# EAGLE design project_2 (EAGLE 9.6.2)
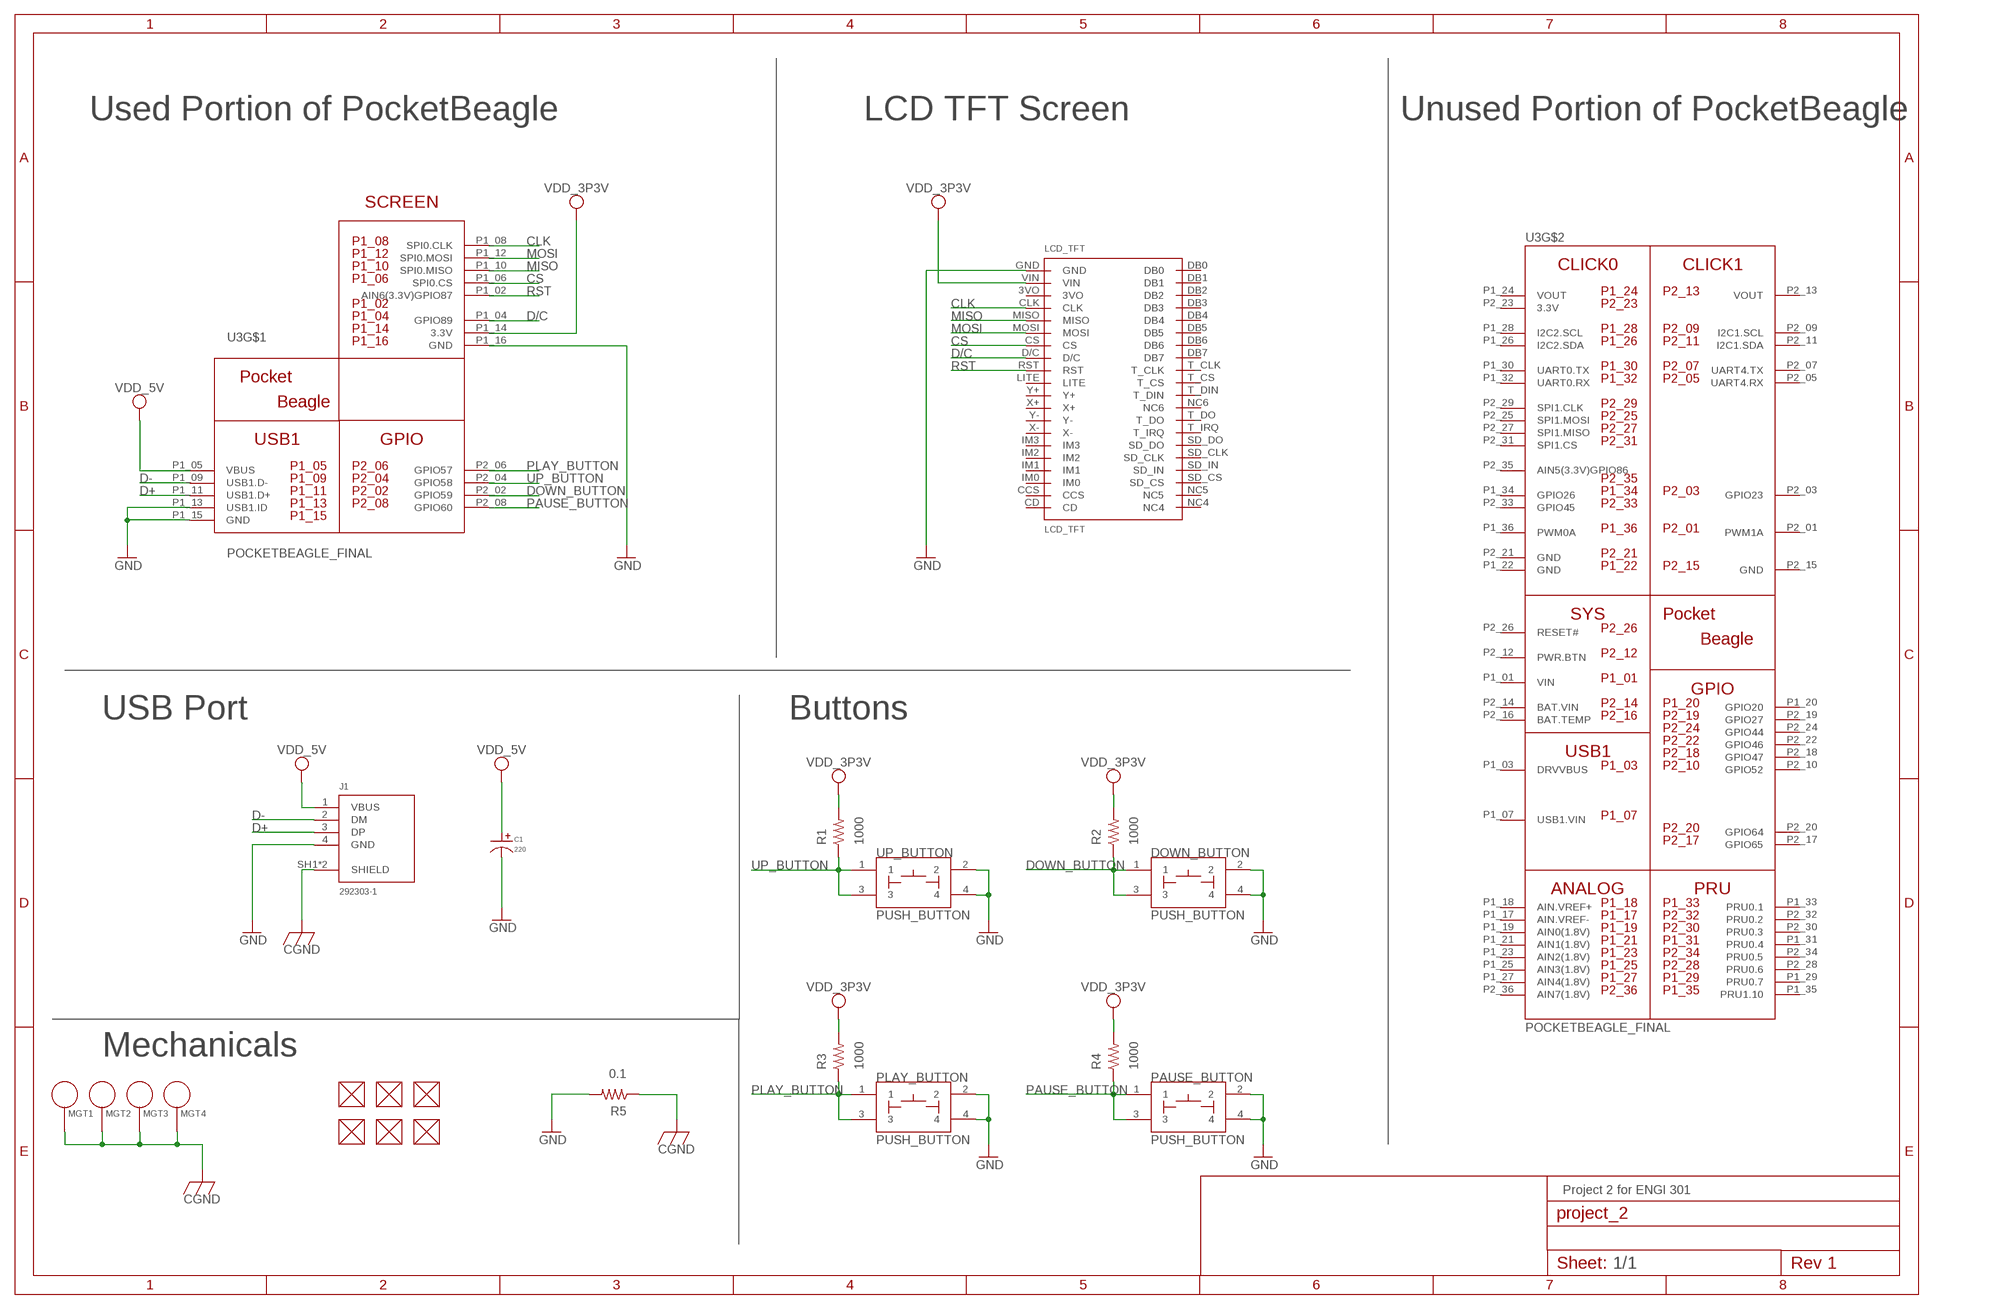
[diagram p0: schematic, sheet 1]

## Parts
C1  220  CAPACITOR_P_10MM  [CP10MM]
DOWN_BUTTON  PUSH_BUTTON  [BUTTON_12.5MM]
FUD1  FIDUCIAL  [FIDUCIAL_40MIL]
FUD2  FIDUCIAL  [FIDUCIAL_40MIL]
FUD3  FIDUCIAL  [FIDUCIAL_40MIL]
FUD4  FIDUCIAL  [FIDUCIAL_40MIL]
FUD5  FIDUCIAL  [FIDUCIAL_40MIL]
FUD6  FIDUCIAL  [FIDUCIAL_40MIL]
J1  292303-1  [TE_292303-1]
LCD_TFT  LCD_TFT  [LCD_TFT]
MGT1  MOUNTING_HOLE  [MOUNTING_HOLE]
MGT2  MOUNTING_HOLE  [MOUNTING_HOLE]
MGT3  MOUNTING_HOLE  [MOUNTING_HOLE]
MGT4  MOUNTING_HOLE  [MOUNTING_HOLE]
PAUSE_BUTTON  PUSH_BUTTON  [BUTTON_12.5MM]
PLAY_BUTTON  PUSH_BUTTON  [BUTTON_12.5MM]
R1  1000  R_R0603  [R0603]
R2  1000  R_R0603  [R0603]
R3  1000  R_R0603  [R0603]
R4  1000  R_R0603  [R0603]
R5  0.1  R_R0603  [R0603]
U3  POCKETBEAGLE_FINAL  [POCKETBEAGLE]
UP_BUTTON  PUSH_BUTTON  [BUTTON_12.5MM]

## Nets
CGND: J1.SH1(SHIELD) J1.SH2(SHIELD) MGT1.P$1 MGT2.P$1 MGT3.P$1 MGT4.P$1 R5.1
CLK: LCD_TFT.CLK U3.P1_08(SPI0.CLK)
CS: LCD_TFT.CS U3.P1_06(SPI0.CS)
D+: J1.3(DP) U3.P1_11(USB1.D+)
D-: J1.2(DM) U3.P1_09(USB1.D-)
D/C: LCD_TFT.D/C U3.P1_04(GPIO89)
DOWN_BUTTON: DOWN_BUTTON.1 DOWN_BUTTON.3 R2.1 U3.P2_02(GPIO59)
GND: C1.P$2 DOWN_BUTTON.2 DOWN_BUTTON.4 J1.4(GND) LCD_TFT.GND PAUSE_BUTTON.2 PAUSE_BUTTON.4 PLAY_BUTTON.2 PLAY_BUTTON.4 R5.2 U3.P1_13(USB1.ID) U3.P1_15(GND) U3.P1_16(GND) UP_BUTTON.2 UP_BUTTON.4
MISO: LCD_TFT.MISO U3.P1_10(SPI0.MISO)
MOSI: LCD_TFT.MOSI U3.P1_12(SPI0.MOSI)
PAUSE_BUTTON: PAUSE_BUTTON.1 PAUSE_BUTTON.3 R4.1 U3.P2_08(GPIO60)
PLAY_BUTTON: PLAY_BUTTON.1 PLAY_BUTTON.3 R3.1 U3.P2_06(GPIO57)
RST: LCD_TFT.RST U3.P1_02(AIN6(3.3V)GPIO87)
UP_BUTTON: R1.1 U3.P2_04(GPIO58) UP_BUTTON.1 UP_BUTTON.3
VDD_3P3V: LCD_TFT.VIN R1.2 R2.2 R3.2 R4.2 U3.P1_14(3.3V)
VDD_5V: C1.P$1 J1.1(VBUS) U3.P1_05(VBUS)
Unconnected: FUD1.P$1 FUD2.P$1 FUD3.P$1 FUD4.P$1 FUD5.P$1 FUD6.P$1 LCD_TFT.3VO LCD_TFT.CCS LCD_TFT.CD LCD_TFT.DB0 LCD_TFT.DB1 LCD_TFT.DB2 LCD_TFT.DB3 LCD_TFT.DB4 LCD_TFT.DB5 LCD_TFT.DB6 LCD_TFT.DB7 LCD_TFT.IM0 LCD_TFT.IM1 LCD_TFT.IM2 LCD_TFT.IM3 LCD_TFT.LITE LCD_TFT.NC4 LCD_TFT.NC5 LCD_TFT.NC6 LCD_TFT.SD_CLK LCD_TFT.SD_CS LCD_TFT.SD_DO LCD_TFT.SD_IN LCD_TFT.T_CLK LCD_TFT.T_CS LCD_TFT.T_DIN LCD_TFT.T_DO LCD_TFT.T_IRQ LCD_TFT.X+ LCD_TFT.X- LCD_TFT.Y+ LCD_TFT.Y- U3.P1_03(DRVVBUS) U3.P1_07(USB1.VIN) U3.P1_17(AIN.VREF-) U3.P1_18(AIN.VREF+) U3.P1_19(AIN0(1.8V)) U3.P1_20(GPIO20) U3.P1_21(AIN1(1.8V)) U3.P1_23(AIN2(1.8V)) U3.P1_25(AIN3(1.8V)) U3.P1_26(I2C2.SDA) U3.P1_27(AIN4(1.8V)) U3.P1_28(I2C2.SCL) U3.P1_29(PRU0.7) U3.P1_30(UART0.TX) U3.P1_31(PRU0.4) U3.P1_32(UART0.RX) U3.P1_33(PRU0.1) U3.P1_34(GPIO26) U3.P1_35(PRU1.10) U3.P1_36(PWM0A) U3.P2_01(PWM1A) U3.P2_03(GPIO23) U3.P2_05(UART4.RX) U3.P2_07(UART4.TX) U3.P2_09(I2C1.SCL) U3.P2_10(GPIO52) U3.P2_11(I2C1.SDA) U3.P2_12(PWR.BTN) U3.P2_16(BAT.TEMP) U3.P2_17(GPIO65) U3.P2_18(GPIO47) U3.P2_19(GPIO27) U3.P2_20(GPIO64) U3.P2_22(GPIO46) U3.P2_24(GPIO44) U3.P2_25(SPI1.MOSI) U3.P2_26(RESET#) U3.P2_27(SPI1.MISO) U3.P2_28(PRU0.6) U3.P2_29(SPI1.CLK) U3.P2_30(PRU0.3) U3.P2_31(SPI1.CS) U3.P2_32(PRU0.2) U3.P2_33(GPIO45) U3.P2_34(PRU0.5) U3.P2_35(AIN5(3.3V)GPIO86) U3.P2_36(AIN7(1.8V))

## Notes on the sheet
- Used Portion of PocketBeagle | LCD TFT Screen | Unused Portion of PocketBeagle
- POCKETBEAGLE_FINAL
- USB Port | Buttons
- Mechanicals
- Project 2 for ENGI 301
- 1/1

## Power pins joined to a net without a drawn wire
3.3V: U3.P2_23(3.3V)
BAT.VIN: U3.P2_14(BAT.VIN)
GND: U3.P1_22(GND) U3.P2_15(GND) U3.P2_21(GND)
VIN: U3.P1_01(VIN)
VOUT: U3.P1_24(VOUT) U3.P2_13(VOUT)

## Library data of the parts
C1 = project_2:CAPACITOR_P: Library: MF_Passives Description: Device for Polarized Capacitors. Manufacture part number (MPN), Voltage Rating, and Tolerance can be added via Attributes. Check https://factory.macrofab.com/parts for the house parts list.; POPULATE: 1
DOWN_BUTTON PAUSE_BUTTON PLAY_BUTTON UP_BUTTON = project_2:PUSH_BUTTON
FUD1-FUD6 = project_2:FIDUCIAL
J1 = project_2:292303-1: CONN USB RECEPT R/A TYPE A 4POS; CENTERLINE_PITCH: 2 mm[.078 in]; COMMENT: 292303-1; DESCRIPTION: Conn; Data; USB; Recept; 2.0; 4 Pos; 1 Port; Rt Angle; A Ser; Tin over Copper; DIGI-KEY_PART_NUMBER: A31726-ND; EU_ROHS_COMPLIANCE: Compliant; MF: TE Connectivity; MP: 292303-1; NUMBER_OF_POSITIONS: 4; PACKAGE: None; PRODUCT_TYPE: Connector; PURCHASE-URL: https://pricing.snapeda.com/search/part/292303-1/?ref=eda
LCD_TFT = project_2:LCD_TFT
MGT1-MGT4 = project_2:MOUNTING_HOLE: Chassis Mounting Hole w/GND connection ability
R1-R5 = project_2:R_: RESISTOR, American symbol
U3 = project_2:POCKETBEAGLE_FINAL

## Board
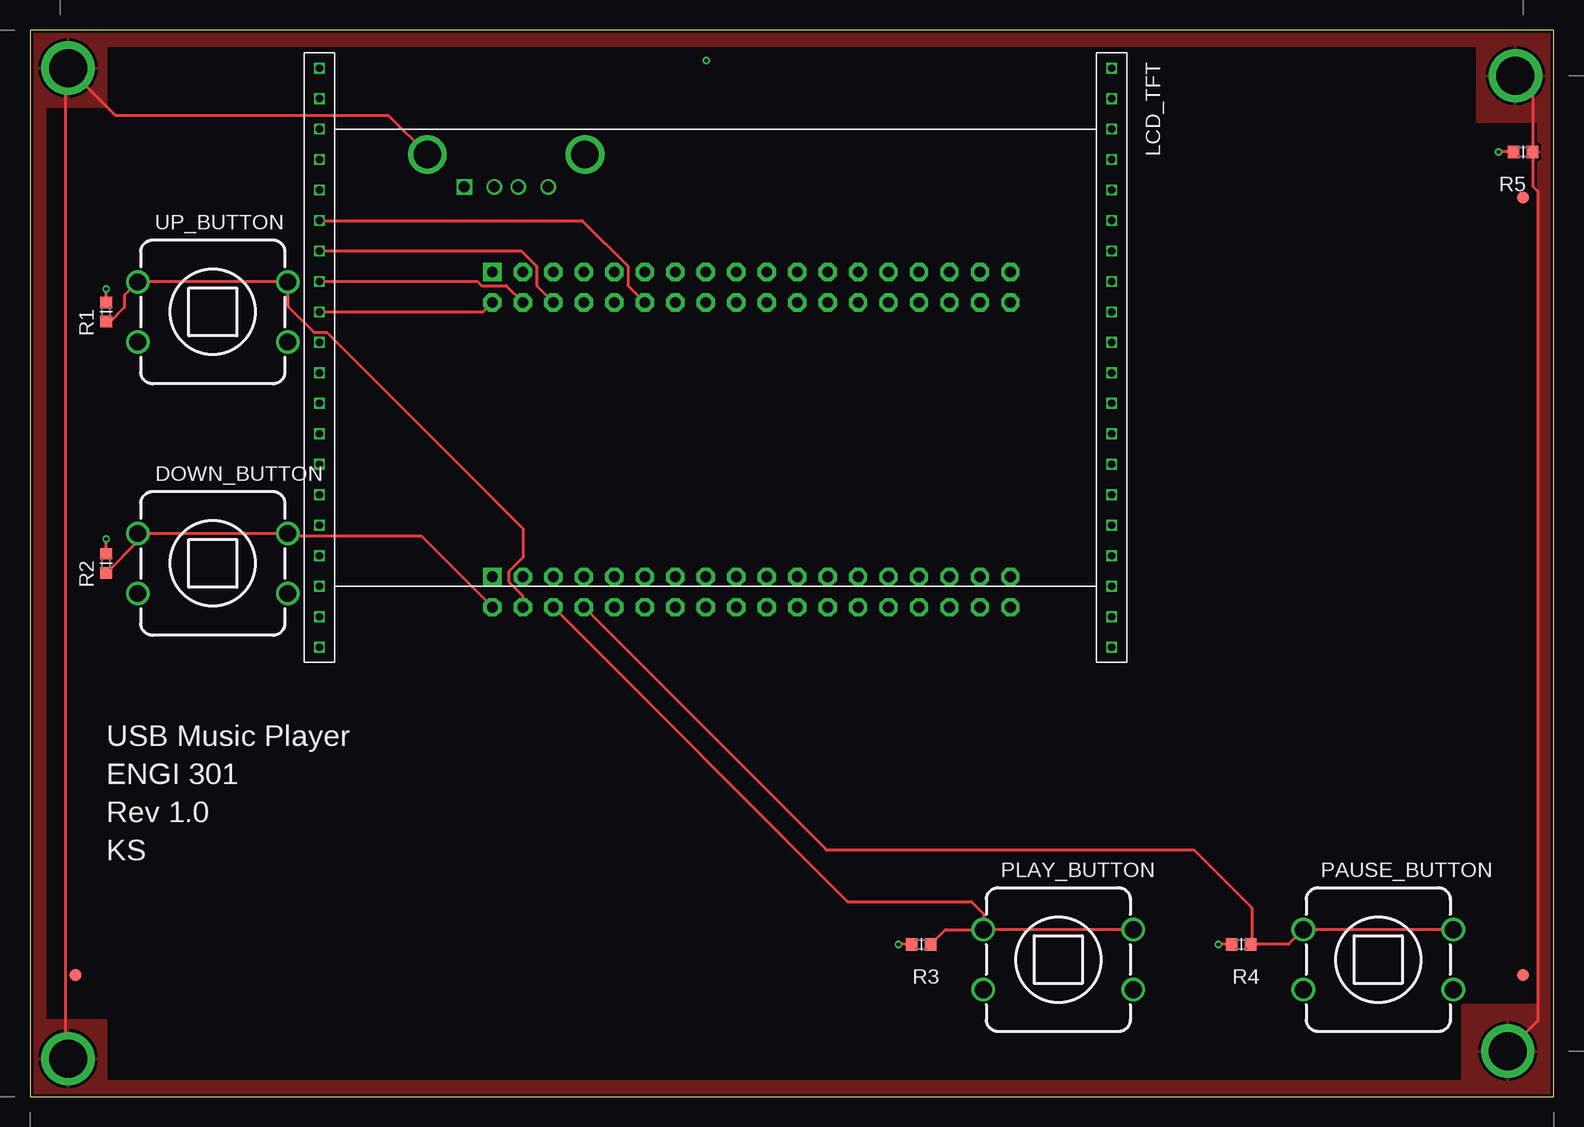
[diagram p1: board, top side]
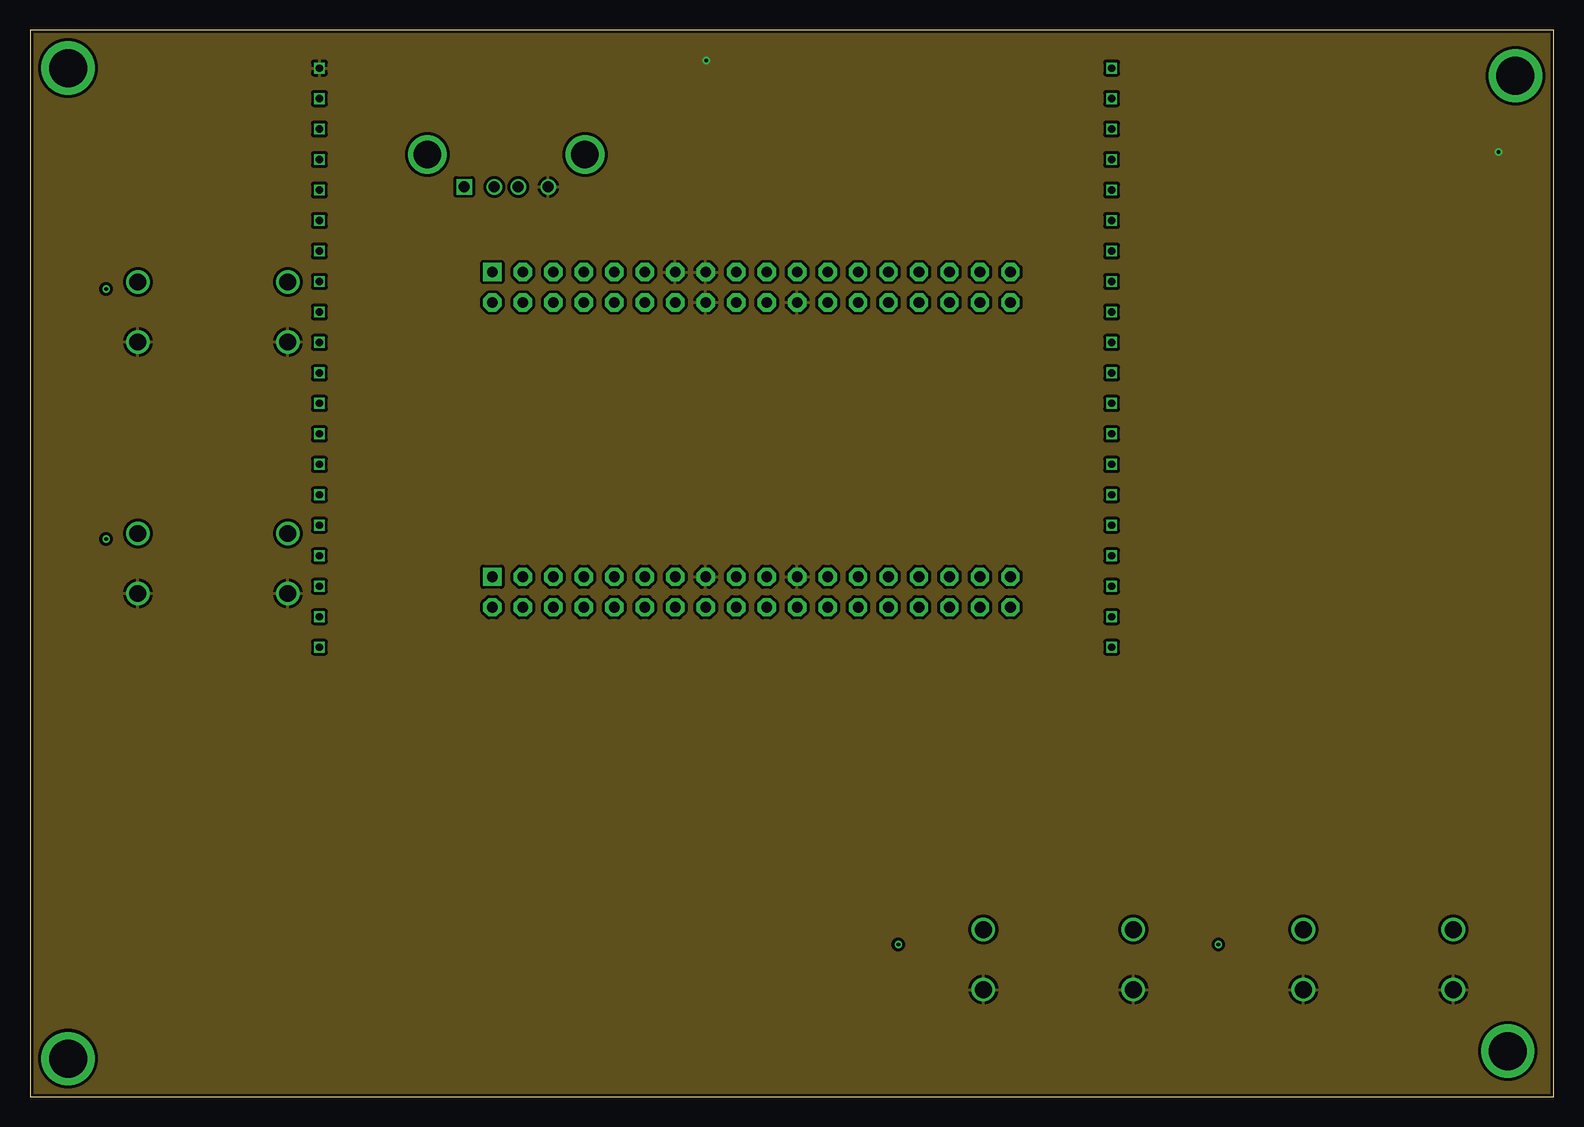
[diagram p2: board, inner layer Route2]
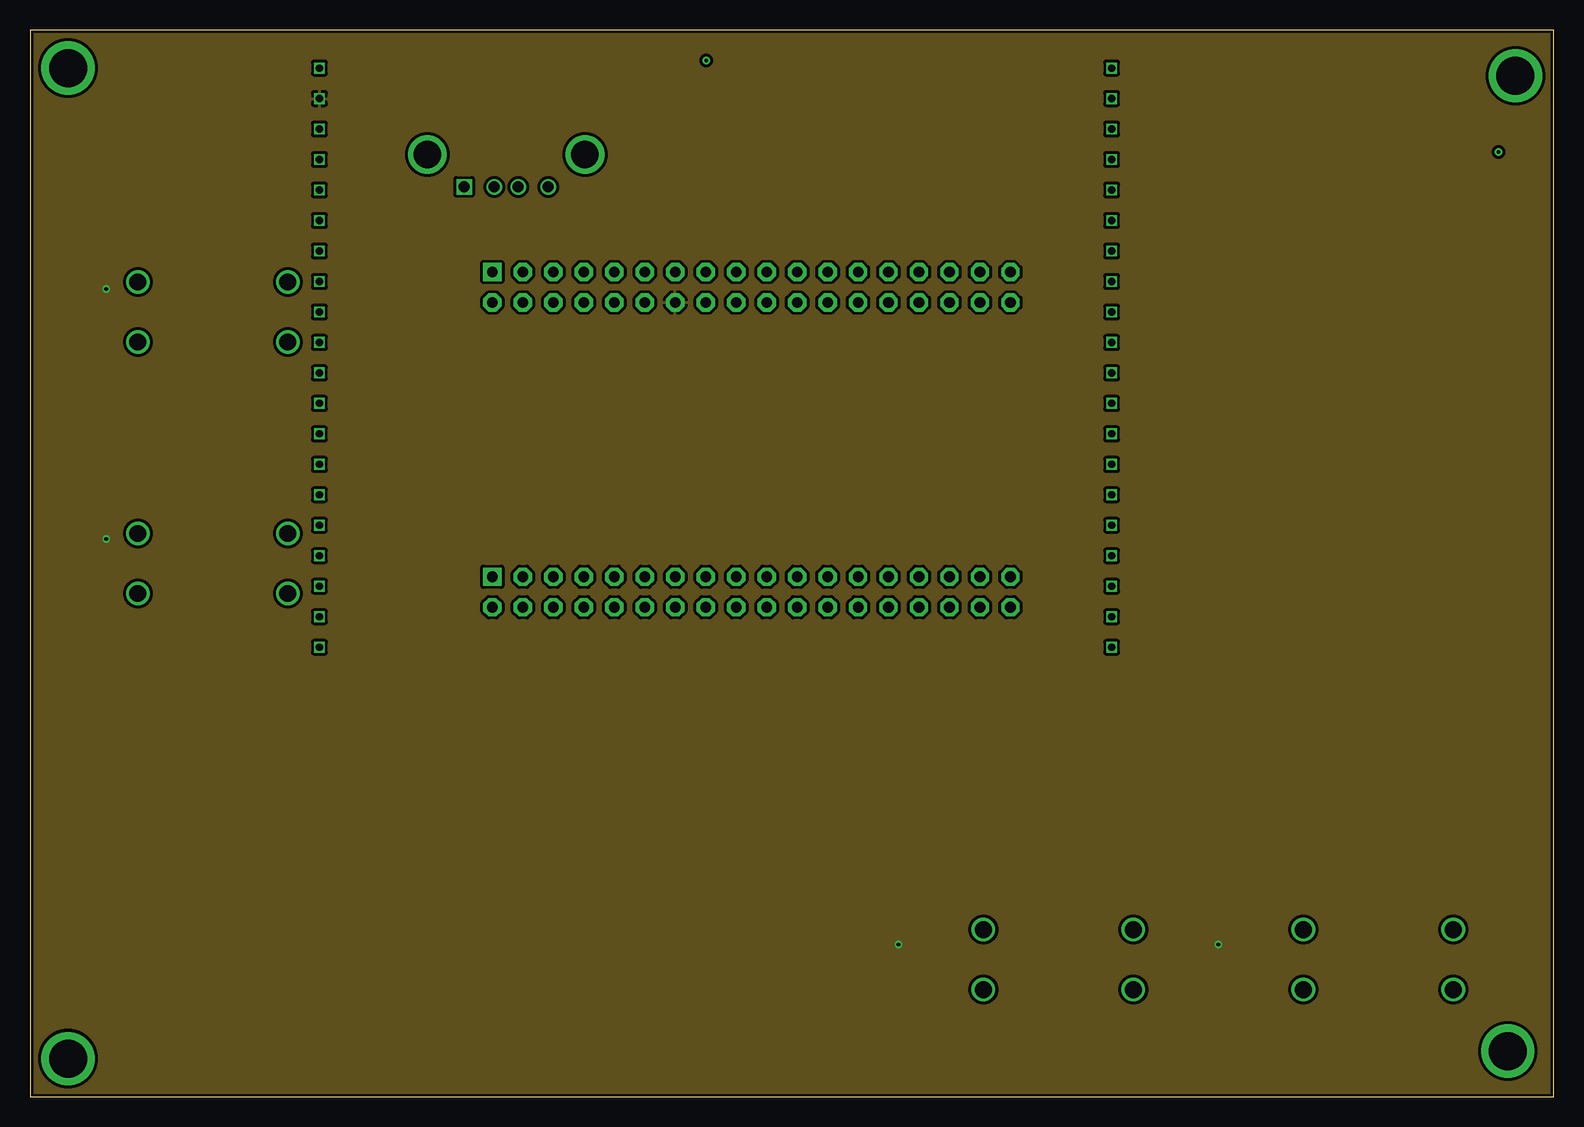
[diagram p3: board, inner layer Route15]
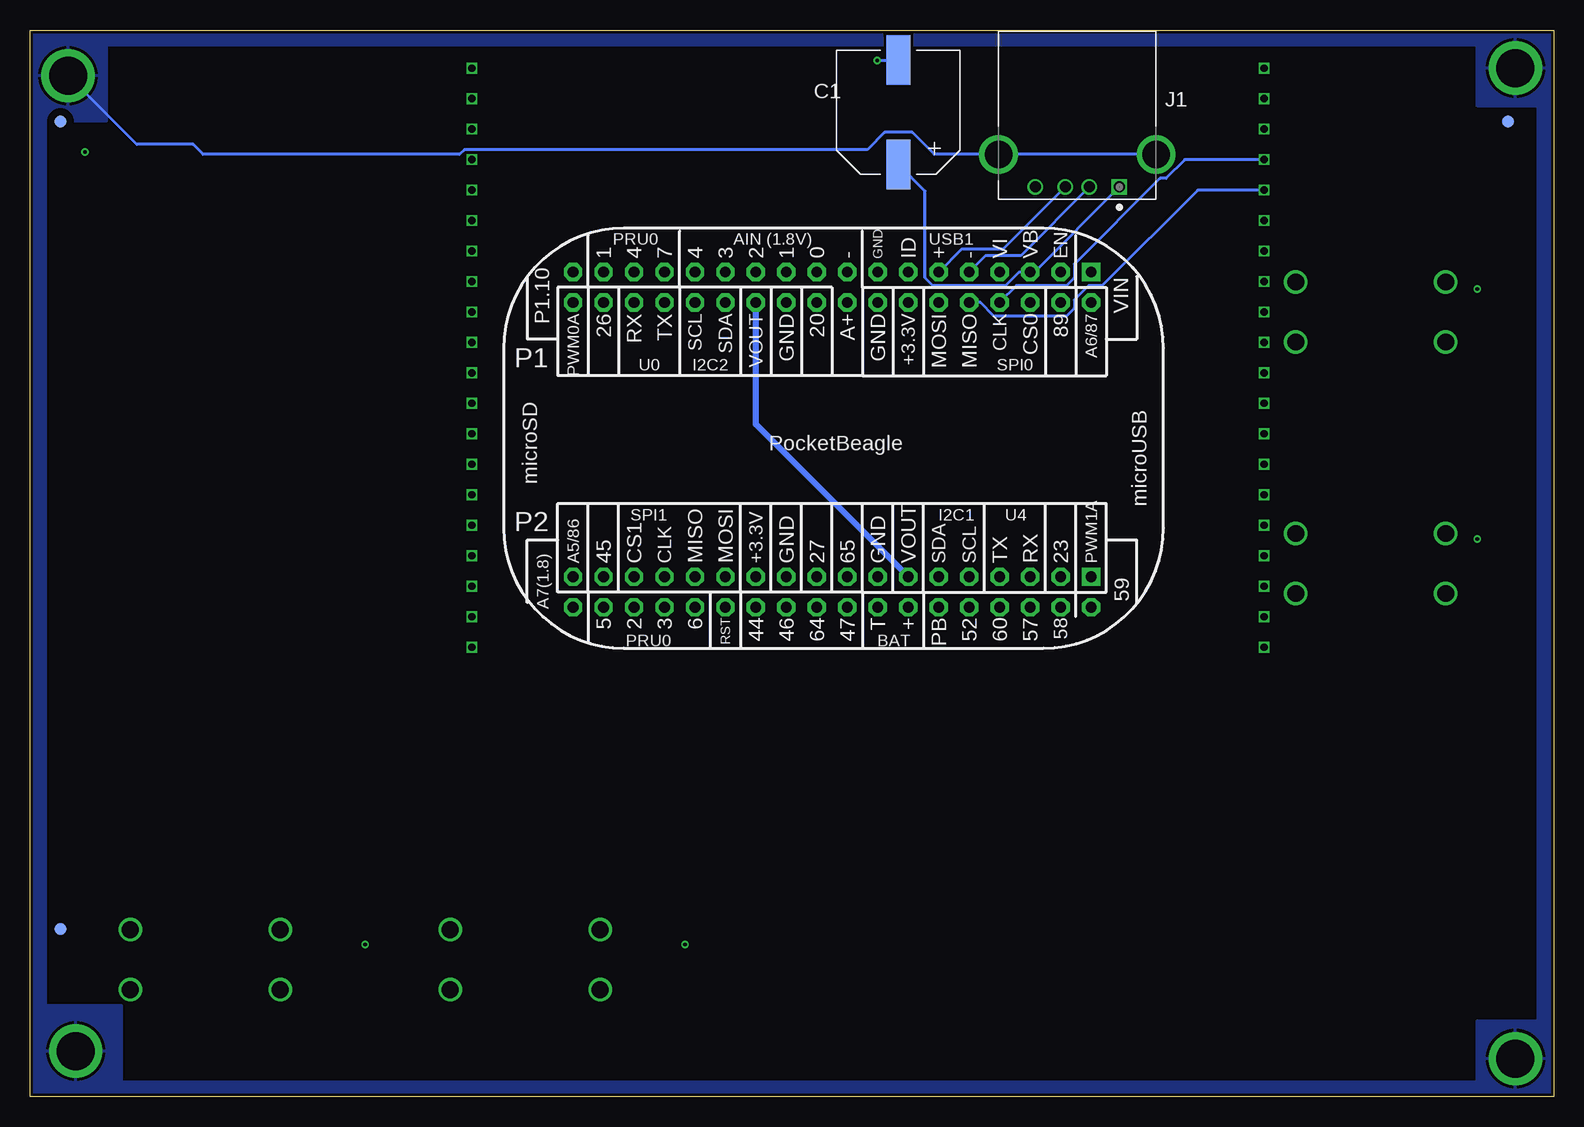
[diagram p4: board, bottom side, seen from below]

Size 127 x 88.9 mm. Coordinates in mm from the lower left corner, seen from the top.
Outline: 0,0 127,0 127,88.9 0,88.9 0,0
Copper layers (1*2*15*16): Top 0.035mm / dielectric 0.23mm / Route2 0.035mm / dielectric 0.93mm / Route15 0.035mm / dielectric 0.23mm / Bottom 0.035mm
Design rules "ENGI301_4lyr": minimum track width 10mil, minimum drill 12mil, track to track 10mil, track to pad 10mil, pad to pad 10mil, via to via 10mil, smd to smd 10mil, copper to edge 10mil, drill to drill 12mil, minimum pad ring 6mil, minimum via ring 6mil, stop-mask expansion 3mil, vias tented up to drill 25mil, thermal gap 10mil

### Footprints (pad centres in the part's own frame; a part is rotated, then mirrored left to right if it is on the bottom)
CP10MM = smd 2 x 4.1: P$1 0,-4.35; P$2 0,4.35
BUTTON_12.5MM = drill 1.4: 1 -6.25,2.5; 2 -6.25,-2.5; 3 6.25,2.5; 4 6.25,-2.5
FIDUCIAL_40MIL = smd 1.016 x 1.016: P$1 0,0
TE_292303-1 = drill 0.92 square: 1 0,0 | drill 0.92: 2 2.5,0; 3 4.5,0; 4 7,0 | drill 2.3: SH1 -3.07,-2.71; SH2 10.07,-2.71
LCD_TFT = drill 0.6 square: 3VO 5.08,1.27; CCS 45.72,1.27; CD 48.26,1.27; CLK 7.62,1.27; CS 15.24,1.27; D/C 17.78,1.27; DB0 0,67.31; DB1 2.54,67.31; DB2 5.08,67.31; DB3 7.62,67.31; DB4 10.16,67.31; DB5 12.7,67.31; DB6 15.24,67.31; DB7 17.78,67.31; GND 0,1.27; IM0 43.18,1.27; IM1 40.64,1.27; IM2 38.1,1.27; IM3 35.56,1.27; LITE 22.86,1.27; MISO 10.16,1.27; MOSI 12.7,1.27; NC4 48.26,67.31; NC5 45.72,67.31; NC6 27.94,67.31; RST 20.32,1.27; SD_CLK 38.1,67.31; SD_CS 43.18,67.31; SD_DO 35.56,67.31; SD_IN 40.64,67.31; T_CLK 20.32,67.31; T_CS 22.86,67.31; T_DIN 25.4,67.31; T_DO 30.48,67.31; T_IRQ 33.02,67.31; VIN 2.54,1.27; X+ 27.94,1.27; X- 33.02,1.27; Y+ 25.4,1.27; Y- 30.48,1.27
MOUNTING_HOLE = drill 3.175 pad 4.445: P$1 0,0
R0603 = smd 0.95 x 1.031: 1 -0.8,0; 2 0.8,0
POCKETBEAGLE = drill 0.889 pad 1.524 square: P1_01 5.91,3.53; P2_01 5.91,28.93 | drill 0.889 pad 1.524 octagon: P1_02 5.91,6.07; P1_03 8.45,3.53; P1_04 8.45,6.07; P1_05 10.99,3.53; P1_06 10.99,6.07; P1_07 13.53,3.53; P1_08 13.53,6.07; P1_09 16.07,3.53; P1_10 16.07,6.07; P1_11 18.61,3.53; P1_12 18.61,6.07; P1_13 21.15,3.53; P1_14 21.15,6.07; P1_15 23.69,3.53; P1_16 23.69,6.07; P1_17 26.23,3.53; P1_18 26.23,6.07; P1_19 28.77,3.53; P1_20 28.77,6.07; P1_21 31.31,3.53; P1_22 31.31,6.07; P1_23 33.85,3.53; P1_24 33.85,6.07; P1_25 36.39,3.53; P1_26 36.39,6.07; P1_27 38.93,3.53; P1_28 38.93,6.07; P1_29 41.47,3.53; P1_30 41.47,6.07; P1_31 44.01,3.53; P1_32 44.01,6.07; P1_33 46.55,3.53; P1_34 46.55,6.07; P1_35 49.09,3.53; P1_36 49.09,6.07; P2_02 5.91,31.47; P2_03 8.45,28.93; P2_04 8.45,31.47; P2_05 10.99,28.93; P2_06 10.99,31.47; P2_07 13.53,28.93; P2_08 13.53,31.47; P2_09 16.07,28.93; P2_10 16.07,31.47; P2_11 18.61,28.93; P2_12 18.61,31.47; P2_13 21.15,28.93; P2_14 21.15,31.47; P2_15 23.69,28.93; P2_16 23.69,31.47; P2_17 26.23,28.93; P2_18 26.23,31.47; P2_19 28.77,28.93; P2_20 28.77,31.47; P2_21 31.31,28.93; P2_22 31.31,31.47; P2_23 33.85,28.93; P2_24 33.85,31.47; P2_25 36.39,28.93; P2_26 36.39,31.47; P2_27 38.93,28.93; P2_28 38.93,31.47; P2_29 41.47,28.93; P2_30 41.47,31.47; P2_31 44.01,28.93; P2_32 44.01,31.47; P2_33 46.55,28.93; P2_34 46.55,31.47; P2_35 49.09,28.93; P2_36 49.09,31.47

### Placement (x,y rotation side)
C1  54.61,82.04 0 bottom
DOWN_BUTTON  15.24,44.45 0 top
FUD1  3.81,10.16 0 top
FUD2  124.46,10.16 0 top
FUD3  124.46,74.93 0 top
FUD4  3.81,81.28 0 bottom
FUD5  124.46,81.28 0 bottom
FUD6  124.46,13.97 0 bottom
J1  36.2,75.82 180 bottom
LCD_TFT  22.86,85.72 270 top
MGT1  3.17,85.72 0 top
MGT2  3.17,3.17 0 top
MGT3  123.19,3.81 0 top
MGT4  123.83,85.09 0 top
PAUSE_BUTTON  112.39,11.43 0 top
PLAY_BUTTON  85.72,11.43 0 top
R1  6.35,65.41 90 top
R2  6.35,44.45 90 top
R3  74.3,12.7 180 top
R4  100.97,12.7 180 top
R5  124.46,78.74 180 top
U3  32.64,72.26 180 bottom
UP_BUTTON  15.24,65.41 0 top

### Tracks (layer width: path | path; a pad name or v marks a point on that pad's centre or on a via)
CGND
  Top 0.254: MGT2.P$1 2.92,3.43 2.92,85.47 MGT1.P$1 7.11,81.79 29.87,81.79 J1.SH1 | MGT4.P$1 125.26,83.66 R5.1 125.26,75.88 125.7,75.44 125.7,6.32 MGT3.P$1
  Bottom 0.254: J1.SH1 J1.SH2 51.6,78.53 53.45,80.38 55.77,80.38 57.21,78.94 90.78,78.94 91.19,78.53 112.56,78.53 113.4,79.36 118.1,79.36 MGT4.P$1
  pour Top: -1.27,90.17 -1.27,52.07 1.27,52.07 1.27,82.55 6.35,82.55 6.35,87.63 120.65,87.63 120.65,81.28 125.73,81.28 125.73,52.07 128.27,52.07 128.27,90.17
  pour Top: -1.27,52.07 -1.27,-1.27 128.27,-1.27 128.27,52.07 125.73,52.07 125.73,7.62 119.38,7.62 119.38,1.27 6.35,1.27 6.35,6.35 1.27,6.35 1.27,52.07
  pour Bottom: -1.27,90.17 -1.27,52.07 1.27,52.07 1.27,82.55 6.35,82.55 6.35,86.36 6.35,87.63 120.65,87.63 120.65,81.28 125.73,81.28 125.73,52.07 128.27,52.07 128.27,90.17
  pour Bottom: -1.27,52.07 -1.27,-1.27 128.27,-1.27 128.27,52.07 125.73,52.07 125.73,7.62 119.38,7.62 119.38,1.27 6.35,1.27 6.35,6.35 1.27,6.35 1.27,52.07
CLK
  Bottom 0.254: LCD_TFT.CLK 30.73,78.11 32.3,76.54 32.81,76.54 39.95,69.4 39.95,68.26 40.62,67.59 44.77,67.59 U3.P1_08
CS
  Top 0.254: U3.P1_06 42.23,67.59 42.23,69.21 40.95,70.48 LCD_TFT.CS
D+
  Bottom 0.254: J1.3 45.9,70.61 49.37,70.61 U3.P1_11
D-
  Bottom 0.254: J1.2 44.41,70.1 47.34,70.1 U3.P1_09
D/C
  Top 0.254: LCD_TFT.D/C 37.27,67.94 37.63,67.59 39.69,67.59 U3.P1_04
DOWN_BUTTON
  Top 0.254: U3.P2_02 32.65,46.7 21.74,46.7 DOWN_BUTTON.3 DOWN_BUTTON.1 8.99,46.29 R2.1
GND  (via drill 0.3 pad 0.61)
  Top 0.254: R5.2 v122.43,78.74
  Bottom 0.254: v56.39,86.36 54.64,86.36 C1.P$2
  pour Route2: -2.54,91.44 -2.54,-2.54 129.54,-2.54 129.54,91.44
MISO
  Bottom 0.254: LCD_TFT.MISO 29.65,75.56 37.63,67.59 38.77,67.59 39.95,66.41 39.95,65.72 40.62,65.05 46.64,65.05 47.78,66.19 U3.P1_10
MOSI
  Top 0.254: U3.P1_12 49.85,67.59 49.85,69.21 46.03,73.03 LCD_TFT.MOSI
PAUSE_BUTTON
  Top 0.254: PAUSE_BUTTON.3 PAUSE_BUTTON.1 104.92,12.7 101.85,12.7 | 101.85,12.7 R4.1 | U3.P2_08 66.39,20.57 97.03,20.57 101.85,15.75 101.85,12.7
PLAY_BUTTON
  Top 0.254: PLAY_BUTTON.3 PLAY_BUTTON.1 | R3.1 76.33,13.93 PLAY_BUTTON.1 | U3.P2_06 68.17,16.26 78.49,16.26 79.47,15.27 PLAY_BUTTON.1
RST
  Top 0.254: LCD_TFT.RST 37.76,65.41 U3.P1_02
UP_BUTTON
  Top 0.254: R1.1 6.69,64.61 7.87,65.79 7.87,66.79 UP_BUTTON.1 UP_BUTTON.3 21.49,65.89 23.68,63.7 24.74,63.7 41.09,47.35 41.09,44.95 39.95,43.81 39.95,42.86 41.09,41.72 U3.P2_04
VDD_3P3V  (via drill 0.3 pad 0.61)
  Top 0.254: R2.2 v6.35,46.48 | R1.2 v6.35,67.31 | R3.2 v72.39,12.7 | R4.2 v99.06,12.7
  pour Route15: -5.08,93.98 -5.08,-5.08 132.08,-5.08 132.08,93.98
VDD_5V
  Bottom 0.254: J1.1 43.28,68.73 U3.P1_05 44.55,68.73 45.7,67.59 51.72,67.59 52.39,68.26 52.39,75.47 C1.P$1
VOUT
  Bottom 0.508: U3.P2_13 66.49,56.03 U3.P1_24

### Text on the board
tPlace: USB Music Player | ENGI 301 | Rev 1.0 | KS
Document: Note: A Powered USB Hub (1.5" X 3.5") would be glued to the bottom of the PCB and would connect to the USB Port.